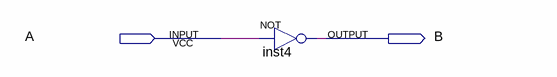
[diagram p0: schematic sheet]
// Quartus schematic AULA1.bdf as structural Verilog: 1 symbols, 2 pins
module AULA1 (
  input  A,
  output B
);

  not inst4 (B, A);
endmodule
